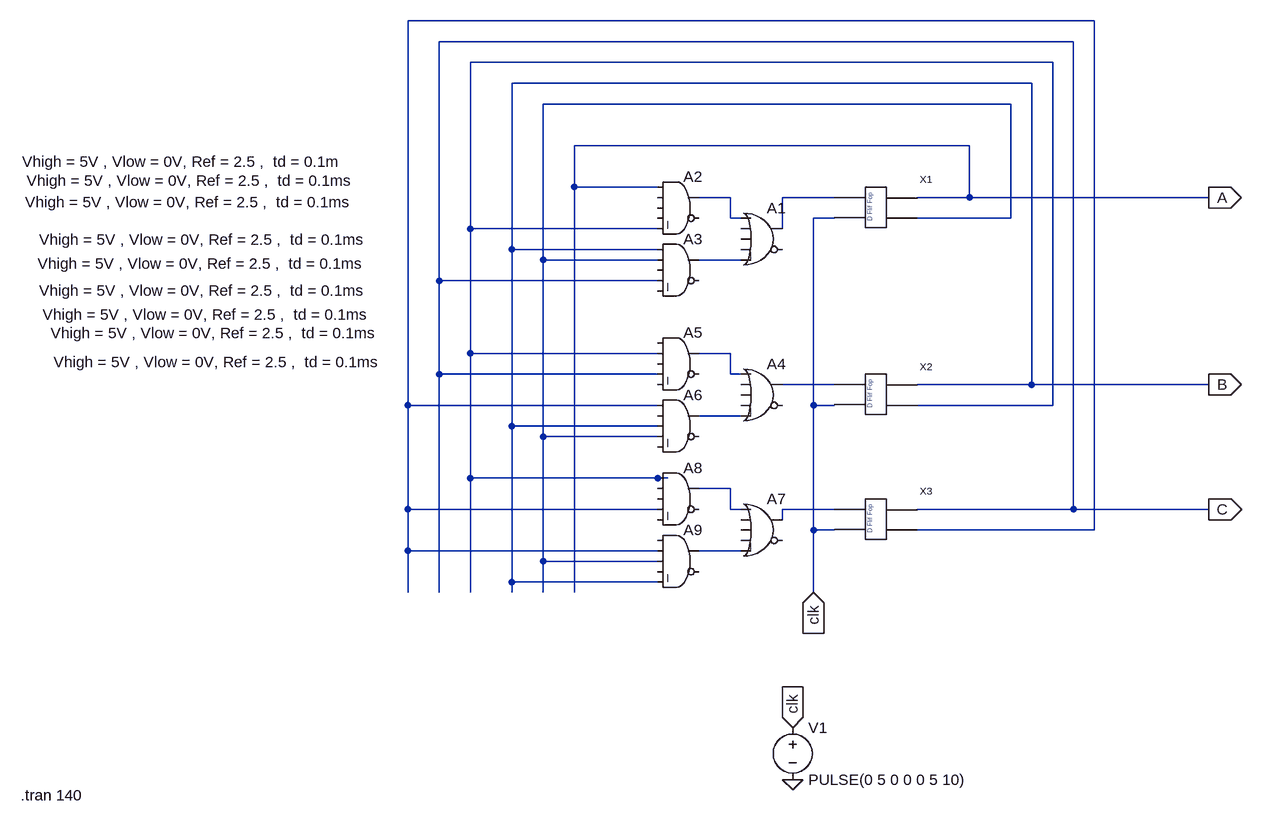
[diagram p0: schematic Draft4.asc]
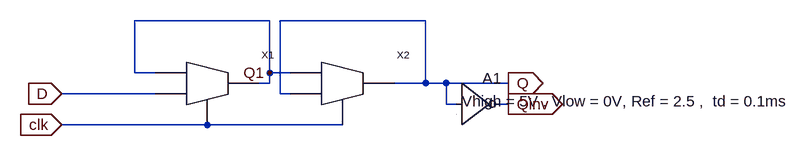
[diagram p1: sub-circuit d_flip_flop.asc]
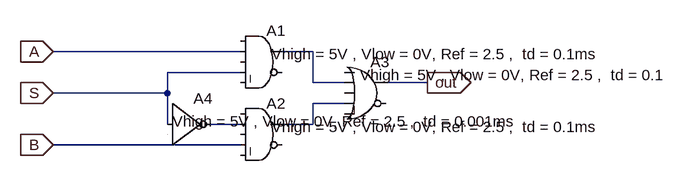
[diagram p2: sub-circuit 2_1_mux.asc]
Draft4.asc, the LTspice schematic file:
Version 4
SHEET 1 880 984
WIRE 608 -224 -448 -224
WIRE 576 -192 -400 -192
WIRE 544 -160 -352 -160
WIRE 512 -128 -288 -128
WIRE 480 -96 -240 -96
WIRE 416 -32 -192 -32
WIRE -192 32 -192 -32
WIRE -64 32 -192 32
WIRE 48 48 0 48
WIRE 208 48 128 48
WIRE 416 48 416 -32
WIRE 416 48 336 48
WIRE 784 48 416 48
WIRE 48 80 48 48
WIRE 64 80 48 80
WIRE 208 80 176 80
WIRE 480 80 480 -96
WIRE 480 80 336 80
WIRE -352 96 -352 -160
WIRE -64 96 -352 96
WIRE 128 96 128 48
WIRE -288 128 -288 -128
WIRE -64 128 -288 128
WIRE -240 144 -240 -96
WIRE -64 144 -240 144
WIRE 64 144 0 144
WIRE -400 176 -400 -192
WIRE -64 176 -400 176
WIRE -352 288 -352 96
WIRE -64 288 -352 288
WIRE 48 288 0 288
WIRE -400 320 -400 176
WIRE -64 320 -400 320
WIRE 48 320 48 288
WIRE 64 320 48 320
WIRE 208 336 128 336
WIRE 512 336 512 -128
WIRE 512 336 336 336
WIRE 784 336 512 336
WIRE -448 368 -448 -224
WIRE -64 368 -448 368
WIRE 176 368 176 80
WIRE 208 368 176 368
WIRE 544 368 544 -160
WIRE 544 368 336 368
WIRE 64 384 0 384
WIRE -288 400 -288 128
WIRE -64 400 -288 400
WIRE -240 416 -240 144
WIRE -64 416 -240 416
WIRE -352 480 -352 288
WIRE -64 480 -352 480
WIRE -48 480 -64 480
WIRE 48 496 0 496
WIRE -448 528 -448 368
WIRE -64 528 -448 528
WIRE 48 528 48 496
WIRE 64 528 48 528
WIRE 208 528 128 528
WIRE 576 528 576 -192
WIRE 576 528 336 528
WIRE 784 528 576 528
WIRE 128 544 128 528
WIRE 176 560 176 368
WIRE 208 560 176 560
WIRE 608 560 608 -224
WIRE 608 560 336 560
WIRE -448 592 -448 528
WIRE -64 592 -448 592
WIRE 64 592 0 592
WIRE -240 608 -240 416
WIRE -64 608 -240 608
WIRE -288 640 -288 400
WIRE -64 640 -288 640
WIRE -448 656 -448 592
WIRE -400 656 -400 320
WIRE -352 656 -352 480
WIRE -288 656 -288 640
WIRE -240 656 -240 608
WIRE -192 656 -192 32
WIRE 176 656 176 560
FLAG 176 656 clk
IOPIN 176 656 In
FLAG 784 48 A
IOPIN 784 48 Out
FLAG 784 336 B
IOPIN 784 336 Out
FLAG 784 528 C
IOPIN 784 528 Out
FLAG 144 864 clk
IOPIN 144 864 In
FLAG 144 944 0
SYMBOL D_flip_flop 272 64 R0
SYMATTR InstName X1
SYMBOL D_flip_flop 272 352 R0
SYMATTR InstName X2
SYMBOL D_flip_flop 272 544 R0
SYMATTR InstName X3
SYMBOL Digital\\or 96 48 R0
WINDOW 3 -1131 -26 Left 2
SYMATTR InstName A1
SYMATTR Value Vhigh = 5V , Vlow = 0V, Ref = 2.5 ,  td = 0.1ms
SYMBOL Digital\\and -32 0 R0
WINDOW 3 -1010 -7 Left 2
SYMATTR InstName A2
SYMATTR Value Vhigh = 5V , Vlow = 0V, Ref = 2.5 ,  td = 0.1m
SYMBOL Digital\\and -32 96 R0
WINDOW 3 -1005 -41 Left 2
SYMATTR InstName A3
SYMATTR Value Vhigh = 5V , Vlow = 0V, Ref = 2.5 ,  td = 0.1ms
SYMBOL Digital\\or 96 288 R0
WINDOW 3 -1112 -97 Left 2
SYMATTR InstName A4
SYMATTR Value Vhigh = 5V , Vlow = 0V, Ref = 2.5 ,  td = 0.1ms
SYMBOL Digital\\and -32 240 R0
WINDOW 3 -984 -127 Left 2
SYMATTR InstName A5
SYMATTR Value Vhigh = 5V , Vlow = 0V, Ref = 2.5 ,  td = 0.1ms
SYMBOL Digital\\and -32 336 R0
WINDOW 3 -986 -186 Left 2
SYMATTR InstName A6
SYMATTR Value Vhigh = 5V , Vlow = 0V, Ref = 2.5 ,  td = 0.1ms
SYMBOL Digital\\or 96 496 R0
WINDOW 3 -1094 -239 Left 2
SYMATTR InstName A7
SYMATTR Value Vhigh = 5V , Vlow = 0V, Ref = 2.5 ,  td = 0.1ms
SYMBOL Digital\\and -32 448 R0
WINDOW 3 -978 -220 Left 2
SYMATTR InstName A8
SYMATTR Value Vhigh = 5V , Vlow = 0V, Ref = 2.5 ,  td = 0.1ms
SYMBOL Digital\\and -32 544 R0
WINDOW 3 -961 -243 Left 2
SYMATTR InstName A9
SYMATTR Value Vhigh = 5V , Vlow = 0V, Ref = 2.5 ,  td = 0.1ms
SYMBOL voltage 144 848 R0
WINDOW 123 0 0 Left 0
WINDOW 39 0 0 Left 0
SYMATTR InstName V1
SYMATTR Value PULSE(0 5 0 0 0 5 10)
TEXT -1044 968 Left 2 !.tran 140

d_flip_flop.asc, the sub-circuit schematic file:
Version 4
SHEET 1 1068 680
WIRE 224 0 16 0
WIRE 464 0 240 0
WIRE 16 80 16 0
WIRE 48 80 16 80
WIRE 224 80 224 0
WIRE 256 80 224 80
WIRE 224 96 224 80
WIRE 224 96 208 96
WIRE 464 96 464 0
WIRE 464 96 416 96
WIRE 496 96 464 96
WIRE 592 96 496 96
WIRE 48 112 -96 112
WIRE 240 112 240 0
WIRE 256 112 240 112
WIRE 496 128 496 96
WIRE 512 128 496 128
WIRE 592 128 576 128
WIRE 128 160 -96 160
WIRE 336 160 128 160
FLAG -96 112 D
IOPIN -96 112 In
FLAG -96 160 clk
IOPIN -96 160 In
FLAG 592 96 Q
IOPIN 592 96 Out
FLAG 592 128 Qinv
IOPIN 592 128 Out
FLAG 224 80 Q1
SYMBOL 2_1_mux 112 96 R0
SYMATTR InstName X1
SYMBOL 2_1_mux 320 96 R0
SYMATTR InstName X2
SYMBOL Digital\\inv 512 64 R0
WINDOW 3 8 60 Left 2
SYMATTR Value Vhigh = 5V , Vlow = 0V, Ref = 2.5 ,  td = 0.1ms
SYMATTR InstName A1

2_1_mux.asc, the sub-circuit schematic file:
Version 4
SHEET 1 880 840
WIRE 160 80 -128 80
WIRE 272 80 224 80
WIRE 160 112 48 112
WIRE 272 128 272 80
WIRE 320 128 272 128
WIRE 448 128 384 128
WIRE 48 144 48 112
WIRE 48 144 -128 144
WIRE 320 160 272 160
WIRE 48 192 48 144
WIRE 160 192 112 192
WIRE 272 192 272 160
WIRE 272 192 224 192
WIRE 160 224 -128 224
FLAG 448 128 out
IOPIN 448 128 Out
FLAG -128 80 A
IOPIN -128 80 In
FLAG -128 144 S
IOPIN -128 144 In
FLAG -128 224 B
IOPIN -128 224 In
SYMBOL Digital\\and 192 32 R0
WINDOW 3 16 52 Left 2
SYMATTR InstName A1
SYMATTR Value Vhigh = 5V , Vlow = 0V, Ref = 2.5 ,  td = 0.1ms
SYMBOL Digital\\and 192 144 R0
WINDOW 3 16 52 Left 2
SYMATTR InstName A2
SYMATTR Value Vhigh = 5V , Vlow = 0V, Ref = 2.5 ,  td = 0.1ms
SYMBOL Digital\\or 352 80 R0
WINDOW 3 -8 36 Left 2
SYMATTR InstName A3
SYMATTR Value Vhigh = 5V , Vlow = 0V, Ref = 2.5 ,  td = 0.1
SYMBOL Digital\\inv 48 128 R0
WINDOW 3 8 60 Left 2
SYMATTR InstName A4
SYMATTR Value Vhigh = 5V , Vlow = 0V, Ref = 2.5 ,  td = 0.001ms

The netlist it stands for:
* Draft4.asc
XX1 N005 clk A N003 d_flip_flop
XX2 N008 clk B N002 d_flip_flop
XX3 N011 clk C N001 d_flip_flop
A1 N004 0 0 0 N006 0 N005 0 OR Vhigh = 5V , Vlow = 0V, Ref = 2.5 ,  td = 0.1ms
A2 A 0 0 0 N002 0 N004 0 AND Vhigh = 5V , Vlow = 0V, Ref = 2.5 ,  td = 0.1m
A3 B N003 0 C 0 0 N006 0 AND Vhigh = 5V , Vlow = 0V, Ref = 2.5 ,  td = 0.1ms
A4 N007 0 0 0 N009 0 N008 0 OR Vhigh = 5V , Vlow = 0V, Ref = 2.5 ,  td = 0.1ms
A5 0 N002 0 C 0 0 N007 0 AND Vhigh = 5V , Vlow = 0V, Ref = 2.5 ,  td = 0.1ms
A6 N001 0 B N003 0 0 N009 0 AND Vhigh = 5V , Vlow = 0V, Ref = 2.5 ,  td = 0.1ms
A7 N010 0 0 0 N012 0 N011 0 OR Vhigh = 5V , Vlow = 0V, Ref = 2.5 ,  td = 0.1ms
A8 N002 0 0 N001 0 0 N010 0 AND Vhigh = 5V , Vlow = 0V, Ref = 2.5 ,  td = 0.1ms
A9 0 N001 N003 0 B 0 N012 0 AND Vhigh = 5V , Vlow = 0V, Ref = 2.5 ,  td = 0.1ms
V1 clk 0 PULSE(0 5 0 0 0 5 10)

* block symbol definitions
.subckt d_flip_flop D clk Q Qinv
XX1 Q1 D clk Q1 2_1_mux
XX2 Q1 Q clk Q 2_1_mux
A1 Q 0 0 0 0 Qinv 0 0 BUF Vhigh = 5V , Vlow = 0V, Ref = 2.5 ,  td = 0.1ms
.ends d_flip_flop

.subckt 2_1_mux A B S out
A1 0 A 0 S 0 0 N001 0 AND Vhigh = 5V , Vlow = 0V, Ref = 2.5 ,  td = 0.1ms
A2 0 N003 0 B 0 0 N002 0 AND Vhigh = 5V , Vlow = 0V, Ref = 2.5 ,  td = 0.1ms
A3 0 N001 0 N002 0 0 out 0 OR Vhigh = 5V , Vlow = 0V, Ref = 2.5 ,  td = 0.1
A4 S 0 0 0 0 N003 0 0 BUF Vhigh = 5V , Vlow = 0V, Ref = 2.5 ,  td = 0.001ms
.ends 2_1_mux

.tran 140
.backanno
.end

* Results of the author's LTspice run, read from the files saved beside the schematic
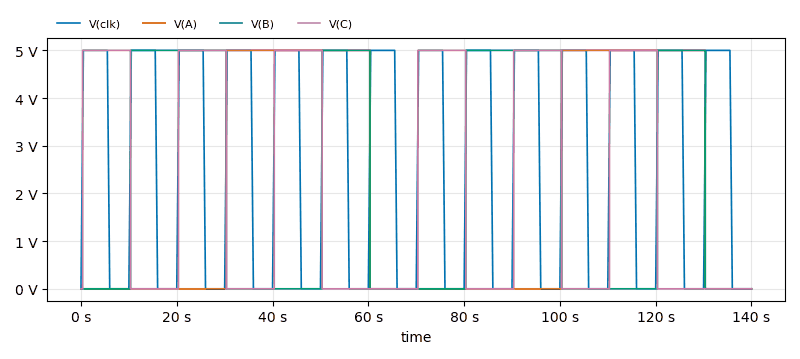
[diagram p3: Transient Analysis of Draft4.asc, plotted from the saved traces]
* Transient Analysis, 1 run:
*   V(clk): min 0 V, max 5 V, average 2.75 V, rms 3.69 V, last 0 V
*   V(A): min 0 V, max 5 V, average 2.143 V, rms 3.273 V, last 0 V
*   V(B): min 0 V, max 5 V, average 2.143 V, rms 3.273 V, last 0 V
*   V(C): min 0 V, max 5 V, average 2.143 V, rms 3.273 V, last 0 V